# EAGLE design pisarnaInGarderoba-v2 (EAGLE 6.5.0)
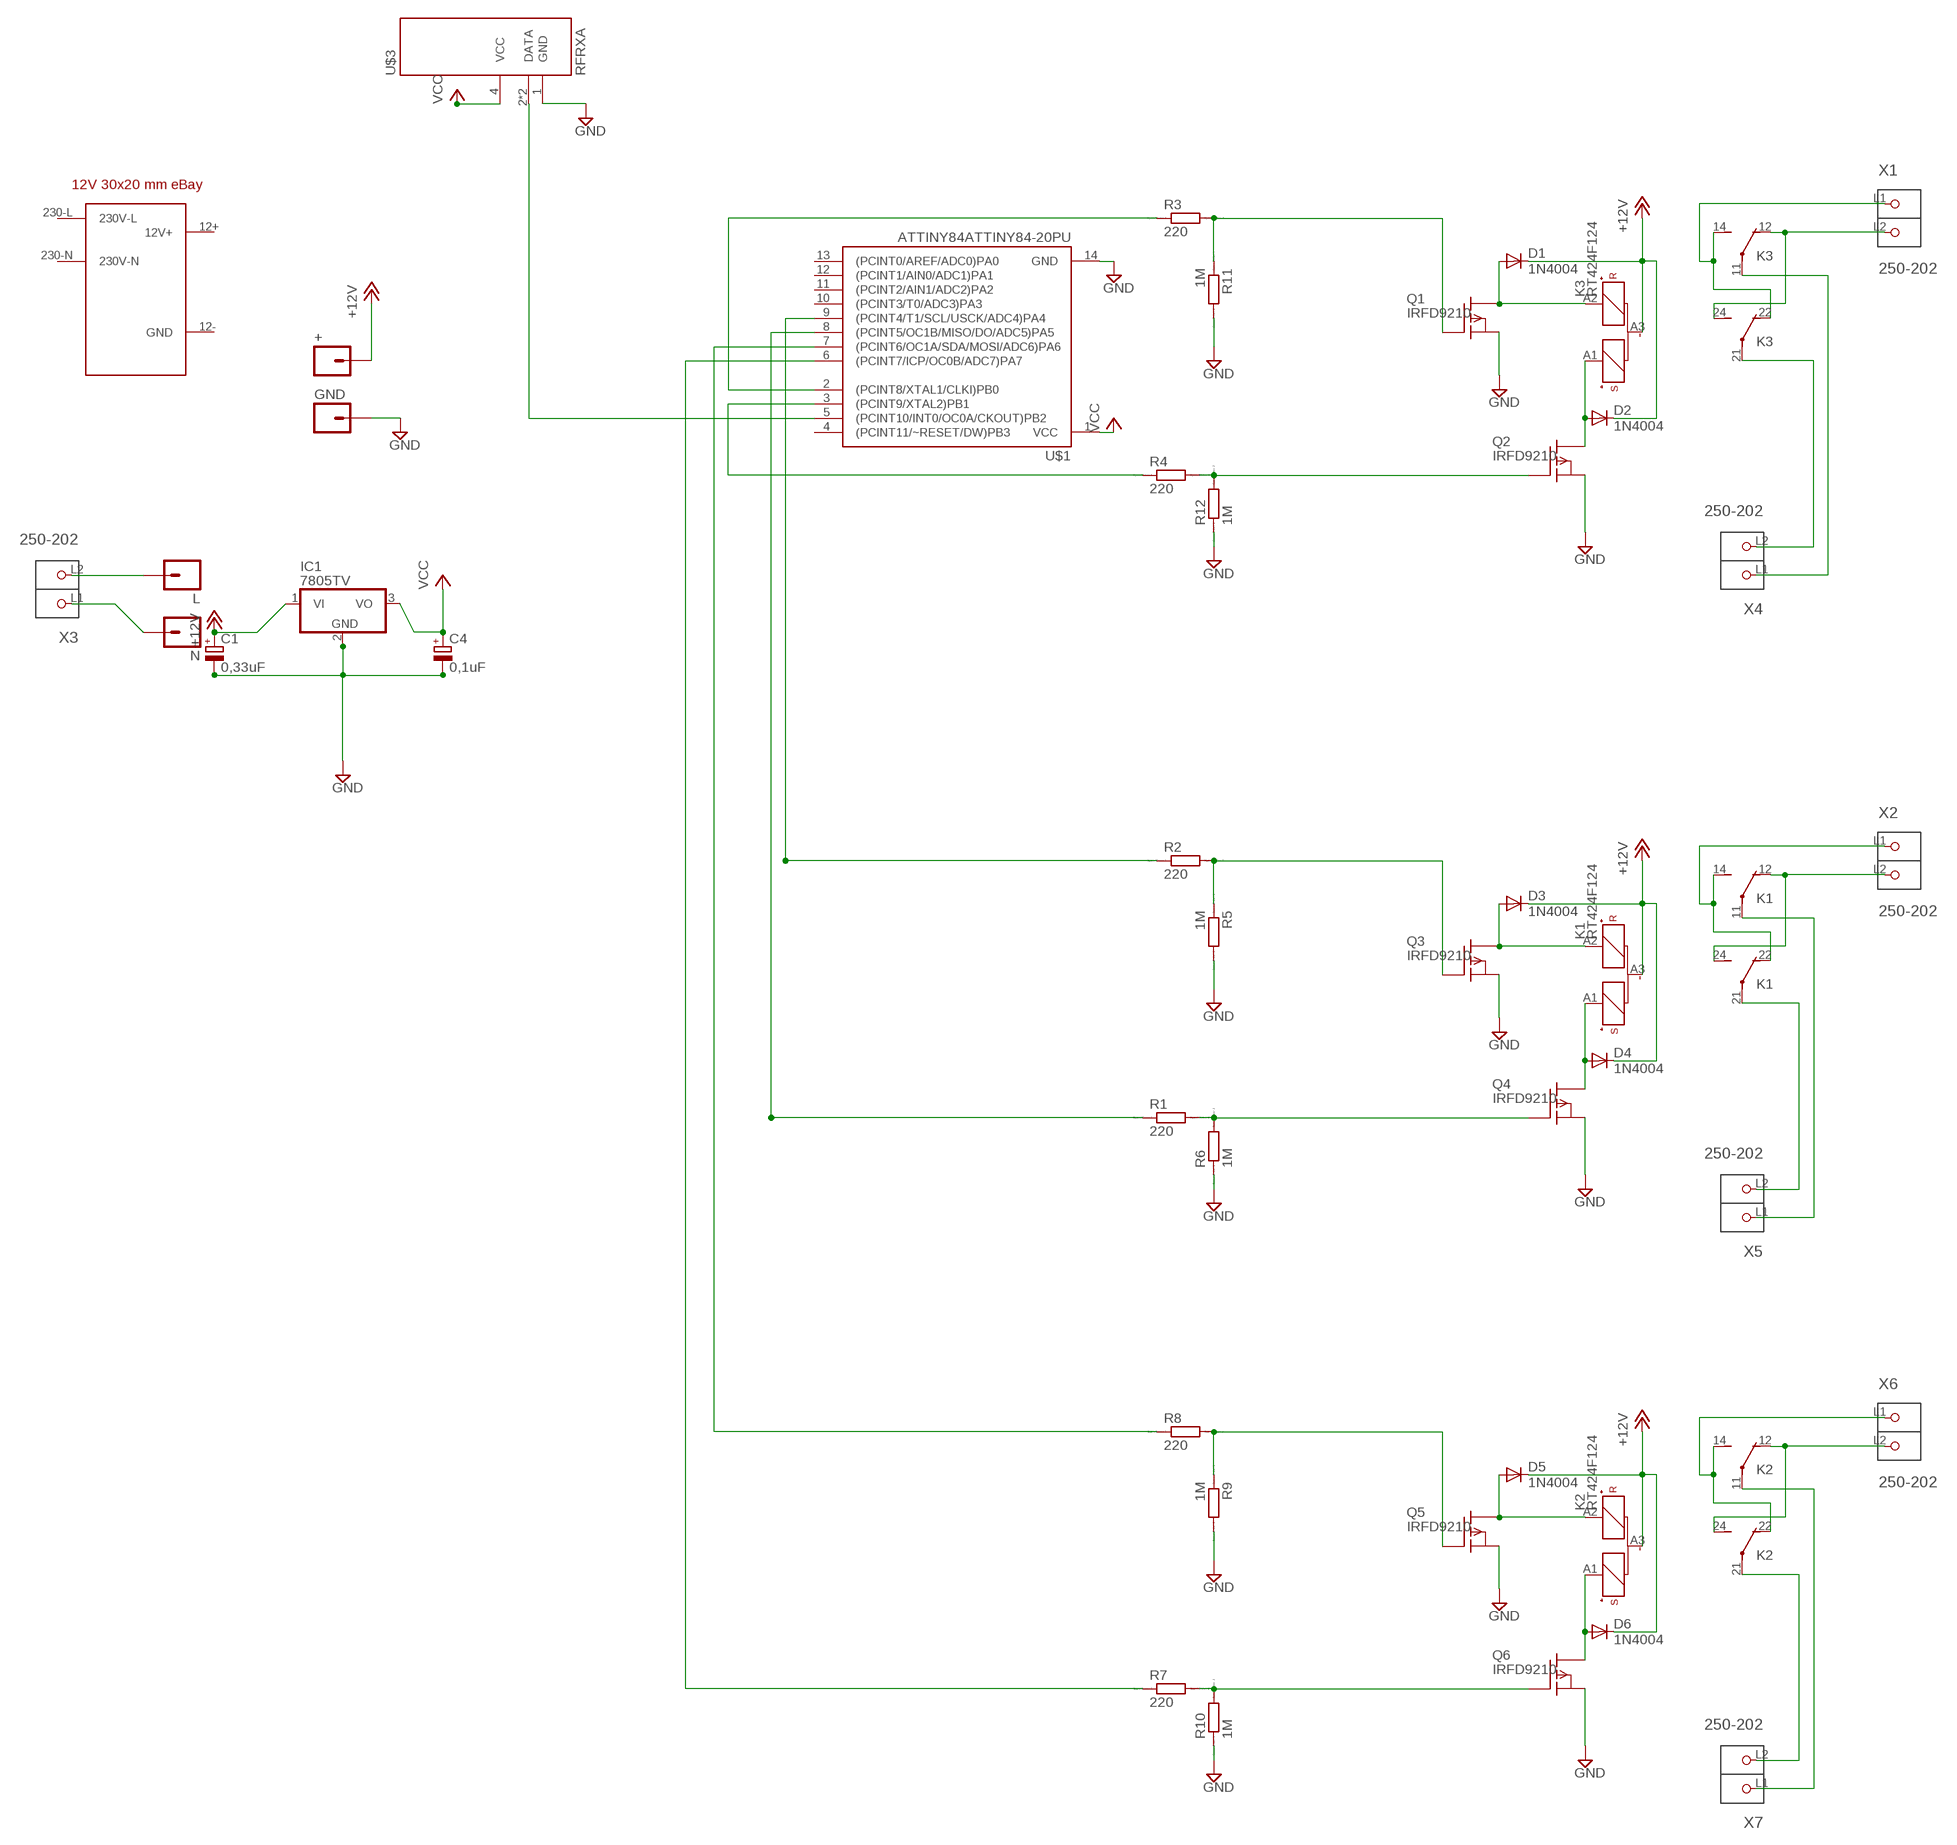
[diagram p0: schematic, sheet 1, part 1 of 2]
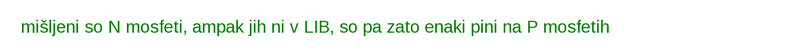
[diagram p1: schematic, sheet 1, part 2 of 2]

## Parts
+  M01PTH  [1X01]
C1  0,33uF  CPOL-EUE2.5-5  [E2,5-5]
C4  0,1uF  CPOL-EUE2.5-5  [E2,5-5]
D1  1N4004  [DO41-10]
D2  1N4004  [DO41-10]
D3  1N4004  [DO41-10]
D4  1N4004  [DO41-10]
D5  1N4004  [DO41-10]
D6  1N4004  [DO41-10]
GND  M01PTH  [1X01]
IC1  7805TV  [TO220V]
K1  RT424F124  [RT424]
K2  RT424F124  [RT424]
K3  RT424F124  [RT424]
L  M01PTH  [1X01]
N  M01PTH  [1X01]
Q1  IRFD9210  [DIL04]
Q2  IRFD9210  [DIL04]
Q3  IRFD9210  [DIL04]
Q4  IRFD9210  [DIL04]
Q5  IRFD9210  [DIL04]
Q6  IRFD9210  [DIL04]
R1  220  R0204/7  [0204/7]
R2  220  R0204/7  [0204/7]
R3  220  R0204/7  [0204/7]
R4  220  R0204/7  [0204/7]
R5  1M  R0204/7  [0204/7]
R6  1M  R0204/7  [0204/7]
R7  220  R0204/7  [0204/7]
R8  220  R0204/7  [0204/7]
R9  1M  R0204/7  [0204/7]
R10  1M  R0204/7  [0204/7]
R11  1M  R0204/7  [0204/7]
R12  1M  R0204/7  [0204/7]
U$1  ATTINY84ATTINY84-20PU  [DIL14]
U$2  12V-30X20  [12V30X20]
U$3  RFRXA  [IC]
X1  250-202  [P-250-202]
X2  250-202  [P-250-202]
X3  250-202  [P-250-202]
X4  250-202  [P-250-202]
X5  250-202  [P-250-202]
X6  250-202  [P-250-202]
X7  250-202  [P-250-202]

## Nets
+12V [mreza]: +.1 C1.+ D1.C D2.C D3.C D4.C D5.C D6.C IC1.1(VI) K1.A3(1:-) K2.A3(1:-) K3.A3(1:-)
GND: C1.- C4.- GND.1 IC1.2(GND) Q1.2(S) Q2.2(S) Q3.2(S) Q4.2(S) Q5.2(S) Q6.2(S) R5.2 R6.1 R9.2 R10.1 R11.2 R12.1 U$1.14(GND) U$3.1(GND)
N$1 [mreza]: K3.21(3:P) X4.L2(P2)
N$3 [mreza]: D2.A K3.A1(1:S+) Q2.3(D) Q2.4(D)
N$4 [mreza]: D1.A K3.A2(1:R+) Q1.3(D) Q1.4(D)
N$5: Q2.1(G) R4.2 R12.2
N$6 [mreza]: K3.11(2:P) X4.L1(P1)
N$7: Q1.1(G) R3.2 R11.1
N$8 [mreza]: K3.12(2:O) K3.24(3:S) X1.L2(P2)
N$9 [mreza]: K3.14(2:S) K3.22(3:O) X1.L1(P1)
N$10: R3.1 U$1.2((PCINT8/XTAL1/CLKI)PB0)
N$11: R4.1 U$1.3((PCINT9/XTAL2)PB1)
N$12: U$1.5((PCINT10/INT0/OC0A/CKOUT)PB2) U$3.2(DATA) U$3.3(DATA)
N$13 [mreza]: K1.21(3:P) X5.L2(P2)
N$14 [mreza]: K1.11(2:P) X5.L1(P1)
N$16: Q4.1(G) R1.2 R6.2
N$17: Q3.1(G) R2.2 R5.1
N$18: R8.1 U$1.7((PCINT6/OC1A/SDA/MOSI/ADC6)PA6)
N$19 [mreza]: D4.A K1.A1(1:S+) Q4.3(D) Q4.4(D)
N$20: R2.1 U$1.9((PCINT4/T1/SCL/USCK/ADC4)PA4)
N$21: R1.1 U$1.8((PCINT5/OC1B/MISO/DO/ADC5)PA5)
N$22 [mreza]: D3.A K1.A2(1:R+) Q3.3(D) Q3.4(D)
N$25 [mreza]: K1.12(2:O) K1.24(3:S) X2.L2(P2)
N$26 [mreza]: K1.14(2:S) K1.22(3:O) X2.L1(P1)
N$27: R7.1 U$1.6((PCINT7/ICP/OC0B/ADC7)PA7)
N$28: Q6.1(G) R7.2 R10.2
N$29: Q5.1(G) R8.2 R9.1
N$30 [mreza]: D6.A K2.A1(1:S+) Q6.3(D) Q6.4(D)
N$32 [mreza]: D5.A K2.A2(1:R+) Q5.3(D) Q5.4(D)
N$33 [mreza]: K2.12(2:O) K2.24(3:S) X6.L2(P2)
N$34 [mreza]: K2.14(2:S) K2.22(3:O) X6.L1(P1)
N$35 [mreza]: K2.21(3:P) X7.L2(P2)
N$36 [mreza]: K2.11(2:P) X7.L1(P1)
N$37 [mreza]: L.1 X3.L2(P2)
N$38 [mreza]: N.1 X3.L1(P1)
VCC: C4.+ IC1.3(VO) U$1.1(VCC) U$3.4(VCC)
Unconnected: U$1.4((PCINT11/~RESET/DW)PB3) U$1.10((PCINT3/T0/ADC3)PA3) U$1.11((PCINT2/AIN1/ADC2)PA2) U$1.12((PCINT1/AIN0/ADC1)PA1) U$1.13((PCINT0/AREF/ADC0)PA0) U$2.12+(12V+) U$2.12-(GND) U$2.230-L(230V-L) U$2.230-N(230V-N)

## Notes on the sheet
- mišljeni so N mosfeti, ampak jih ni v LIB, so pa zato enaki pini na P mosfetih

## Library data of the parts
+ GND L N = SparkFun-Connectors:M01: Header 1 Standard 1-pin 0.1" header. Use with straight break away headers (SKU : PRT-00116), right angle break away headers (PRT-00553), swiss pins (PRT-00743), machine pins (PRT-00117), and female headers (PRT-00115). SMTSO-256-ET is a "flush mount" nut for a 4-40 screw. The older package used to be too tight, and did not allow it to sit properly thru the drill hit. The latest (0.165DIA) fits nice and snug.
C1 C4 = resistor:CPOL-EU: POLARIZED CAPACITOR, European symbol; MF: SPC TECHNOLOGY; MPN: SPC15391; OC_FARNELL: 1653939
D1-D6 = diode:1N4004: DIODE general purpose rectifier, 1 A
IC1 = linear:78*: Positive VOLTAGE REGULATOR Source: http://cache.national.com/ds/LM/LM78L05.pdf http://www.fairchildsemi.com/ds/LM/LM7805.pdf; OC_FARNELL: unknown
K1-K3 = relay:RT424F*: Power PCB Relay polarized bistable version SCHRACK 2 pole 8 A Source: http://www.schrack.com/.. 5843.pdf; OC_FARNELL: unknown; OC_NEWARK: unknown
Q1-Q6 = transistor-fet:IRFD9210: P-Channel Enhancement MOSFET
R1-R12 = eagle-ltspice:R: RESISTOR, European symbol; OC_FARNELL: unknown; SPICEMODEL: NONE; SPICEPREFIX: R
U$1 = SparkFun-DigitalIC:ATTINY84: Atmel 14-pin 2/4/8kB flash uC
U$2 = nejc:12V-30X20
U$3 = RFRX-nejc:RFRX
X1-X7 = con-wago_250:250-202: Serie 250, 1-Leiter-Klemmenleiste für Leiterplatten 1 Lötstift/Pol versetzt / Series 250, 1-conductor PCB terminal strip 1 solder pin/pole, staggered Polzahl / Pole No.: 2 Rastermaß / Pitch: 3.5 - 3.5 mm Bemessungsspannung / Rated Voltage: 320 V Nennstrom / Nominal Current: 8 A Leiterquerschnitt / Conductor Size: 0.2 - 1.5 mm2 Anschlusstechnik / Connection Technology: CAGE CLAMP® S Lötstiftlänge: / Solder Pin Length: 3.6 mm Leitereinführung (zur Platine) / Conductor entry angle (to PCB): 45 ° Farbe / Color: grau / gray Stand: 01.01.2014. Die jeweils aktuellen Daten zu diesem Artikel finden Sie in unserem Produktkatalog, den Sie unter www.wago.com einsehen können. As of: 01/01/2014. Please find the newest data for this article in our product catalogue, which can be viewed under www.wago.com.

## Net classes
0 default: width 0.35 mm, drill 0.8 mm, clearance 0.35 mm
1 mreza: width 0.508 mm, drill 1.2 mm, clearance 0.508 mm

## Board
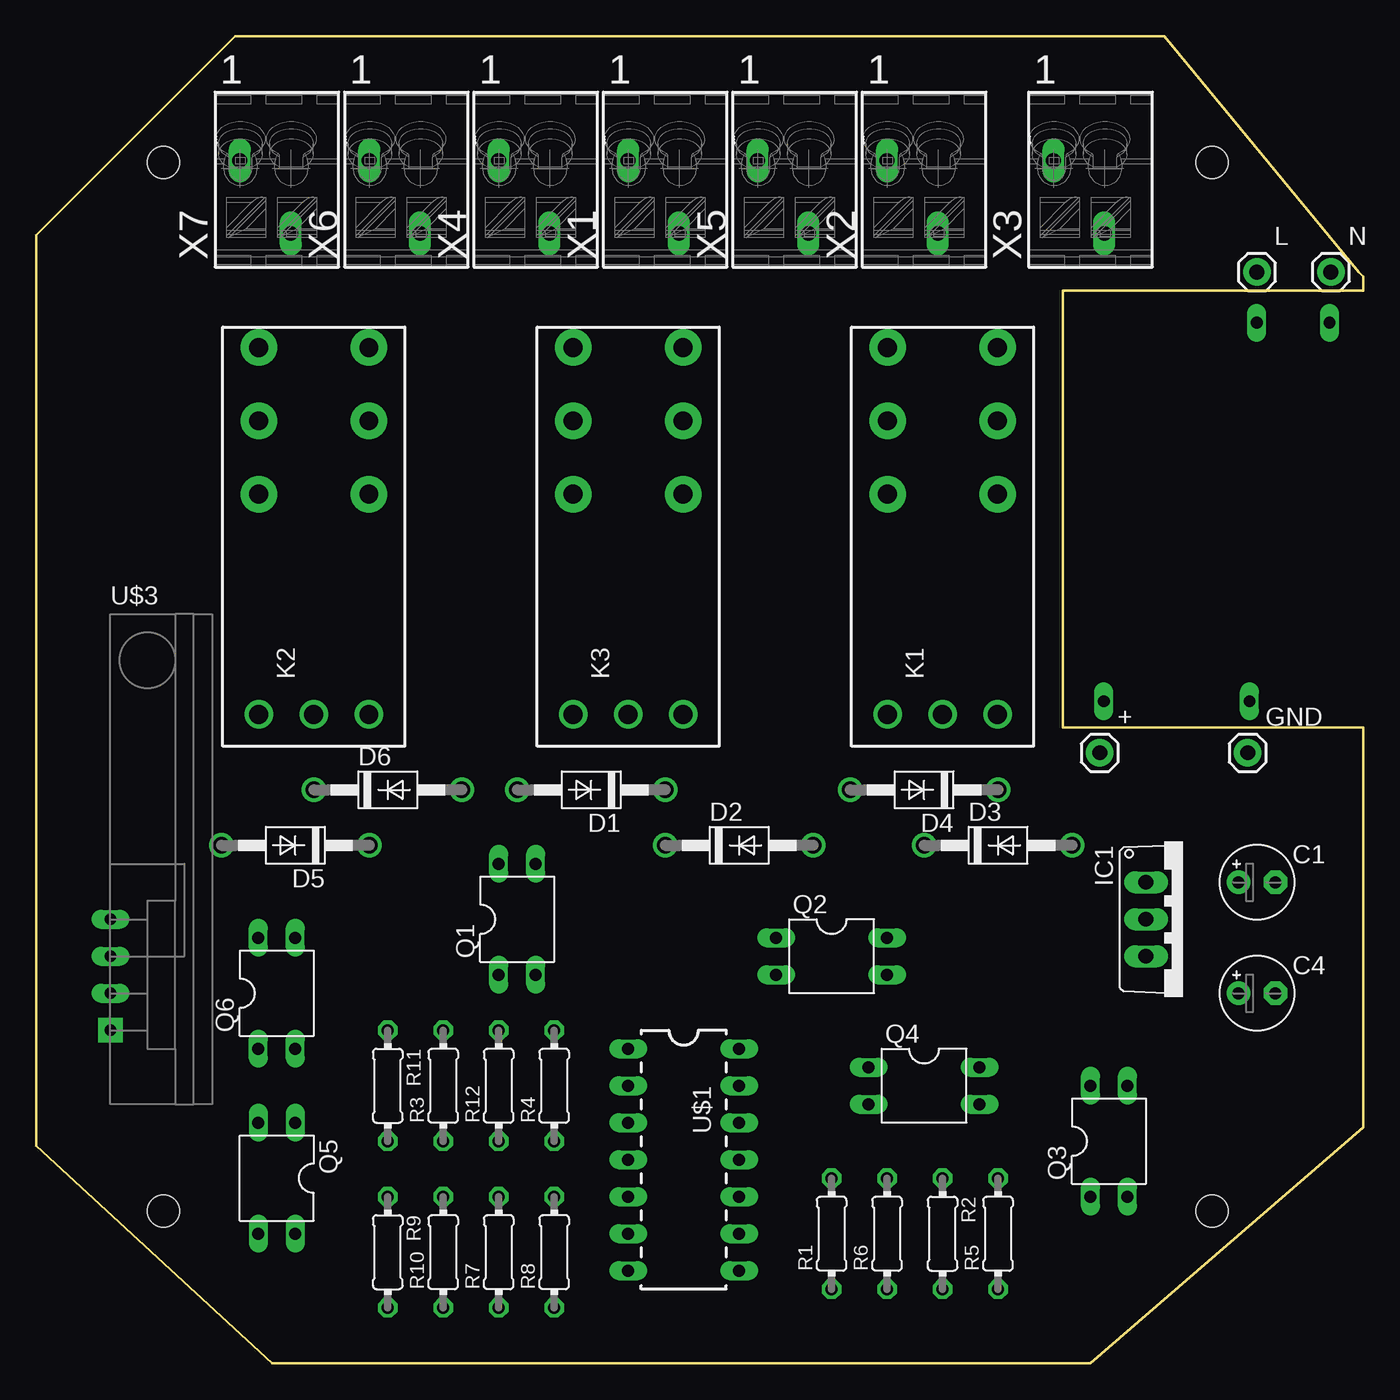
[diagram p2: board, top side]
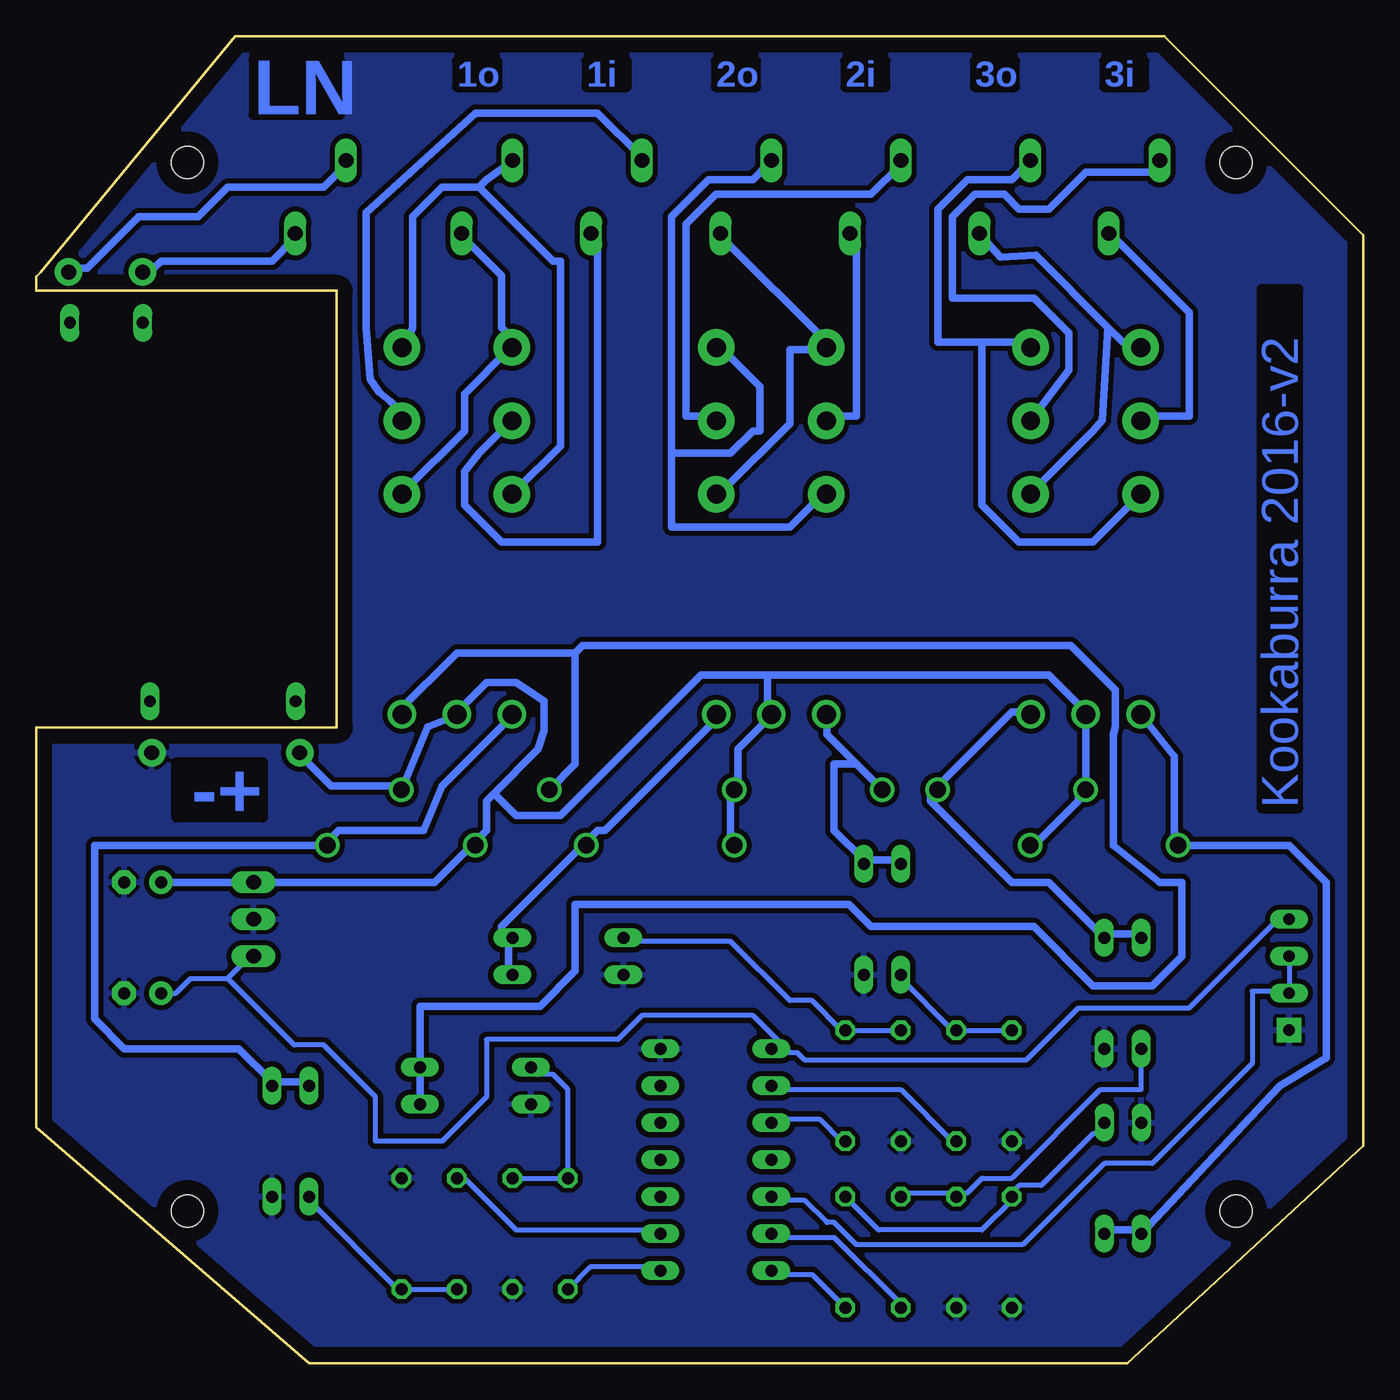
[diagram p3: board, bottom side, seen from below]

Size 91.11 x 91.11 mm. Coordinates in mm from the lower left corner, seen from the top.
Outline: 16.19,0 72.38,0 91.11,16.19 91.11,43.65 70.48,43.65 70.48,73.65 91.11,73.65 91.11,74.6 90.81,74.93 77.46,91.11 13.65,91.11 0,77.46 0,14.92 16.19,0
Copper layers (1*16): Top 0.035mm / dielectric 1.5mm / Bottom 0.035mm
Design rules "default": minimum track width 10mil, minimum drill 24mil, track to track 8mil, track to pad 8mil, pad to pad 8mil, via to via 8mil, smd to smd 8mil, copper to edge 40mil, drill to drill 8mil, minimum pad ring 10mil, minimum via ring 8mil, stop-mask expansion 4mil, vias tented up to drill 0mil, thermal gap 10mil
Holes 2.2 mm at 8.73,82.44 80.73,82.44 8.73,10.44 80.73,10.44

### Footprints (pad centres in the part's own frame; a part is rotated, then mirrored left to right if it is on the bottom)
1X01 = drill 1.016 pad 1.88: 1 0,0
E2,5-5 = drill 0.813 pad 1.6: + -1.27,0 | drill 0.813 pad 1.6 octagon: - 1.27,0
DO41-10 = drill 1.118: A 5.08,0; C -5.08,0
TO220V = drill 1.016 long: 1 -2.54,-2.54; 2 0,-2.54; 3 2.54,-2.54
RT424 = drill 1.3 pad 2.5: 11 7.56,-3.78; 12 2.52,-3.78; 14 12.6,-3.78; 21 7.56,3.78; 22 2.52,3.78; 24 12.6,3.78 | drill 1.3: A1 -12.6,-3.78; A2 -12.6,3.78; A3 -12.6,0
DIL04 = drill 0.813 long: 1 -1.27,-3.81; 2 1.27,-3.81; 3 1.27,3.81; 4 -1.27,3.81
0204/7 = drill 0.813 octagon: 1 -3.81,0; 2 3.81,0
DIL14 = drill 0.813 long: 1 -8.89,-3.81; 2 -6.35,-3.81; 3 -3.81,-3.81; 4 -1.27,-3.81; 5 1.27,-3.81; 6 3.81,-3.81; 7 6.35,-3.81; 8 6.35,3.81; 9 3.81,3.81; 10 1.27,3.81; 11 -1.27,3.81; 12 -3.81,3.81; 13 -6.35,3.81; 14 -8.89,3.81
12V30X20 = drill 0.8 long: 12+ 2.82,2.27; 12- 12.82,2.27; 230-L 18.32,28.27; 230-N 13.32,28.27
IC = drill 0.8 pad 1.676 square: 1 0,5.08 | drill 0.8 long: 2 0,7.62; 3 0,10.16; 4 0,12.7
P-250-202 = drill 1 long: L1 1.3,2.55; L2 -3.7,-0.95

### Placement (x,y rotation side)
+  73.03,41.91 0 top
C1  83.82,33.02 0 top
C4  83.82,25.4 0 top
D1  38.1,39.37 180 top
D2  48.26,35.56 0 top
D3  66.04,35.56 0 top
D4  60.96,39.37 180 top
D5  17.78,35.56 180 top
D6  24.13,39.37 0 top
GND  83.19,41.91 0 top
IC1  78.74,30.48 270 top
K1  62.23,57.15 90 top
K2  19.05,57.15 90 top
K3  40.64,57.15 90 top
L  83.82,74.93 0 top
N  88.9,74.93 0 top
Q1  33.02,30.48 0 top
Q2  54.61,27.94 270 top
Q3  73.66,15.24 0 top
Q4  60.96,19.05 270 top
Q5  16.51,12.7 180 top
Q6  16.51,25.4 0 top
R1  54.61,8.89 90 top
R2  62.23,8.89 270 top
R3  27.94,19.05 90 top
R4  35.56,19.05 90 top
R5  66.04,8.89 90 top
R6  58.42,8.89 90 top
R7  31.75,7.62 90 top
R8  35.56,7.62 90 top
R9  24.13,7.62 270 top
R10  27.94,7.62 90 top
R11  24.13,19.05 270 top
R12  31.75,19.05 90 top
U$1  44.45,12.7 270 top
U$2  70.48,43.18 0 top
U$3  5.08,17.78 0 top
X1  43.18,81.28 90 top
X2  60.96,81.28 90 top
X3  72.39,81.28 90 top
X4  34.29,81.28 90 top
X5  52.07,81.28 90 top
X6  25.4,81.28 90 top
X7  16.51,81.28 90 top

### Tracks (layer width: path | path; a pad name or v marks a point on that pad's centre or on a via)
+12V
  Bottom 0.508: C1.+ IC1.1 63.75,33.02 61.21,35.56 | +.1 72.9,41.66 70.87,39.62 66.29,39.62 D4.C 64.26,43.69 62.99,44.2 62.23,44.2 K1.A3 62.23,44.7 60.2,46.74 58.17,46.74 56.26,45.47 56.26,43.43 56.64,42.16 59.69,39.12 | 59.69,39.12 60.2,38.61 60.2,36.58 61.21,35.56 | 61.21,35.56 D3.C | D2.C 43.43,35.56 43.43,39.12 D1.C 42.93,39.62 42.93,42.16 40.89,44.2 K3.A3 40.89,44.7 40.89,47.24 | D5.C 22.61,35.56 19.56,38.61 19.56,39.12 19.05,39.12 D6.C K2.A3 19.05,44.7 19.56,44.7 19.56,45.21 21.59,47.24 40.89,47.24 | 59.69,39.12 58.17,37.59 55.12,37.59 45.47,47.24 40.89,47.24
GND
  pour Bottom: 13.97,91.44 0,77.47 0,15.24 16.51,-1.27 72.39,-1.27 91.44,16.51 91.44,44.45 71.12,44.45 71.12,73.03 91.44,73.03 91.44,74.93 86.36,81.28 77.47,91.44
N$1
  Bottom 0.508: X4.L2 34.8,77.22 34.8,65.02 36.83,65.02 K3.21
N$3
  Bottom 0.508: Q2.3 58.67,26.92 58.67,28.96 Q2.4 58.67,29.46 59.18,29.46 59.18,29.97 53.59,35.56 | 53.59,35.56 52.58,36.58 52.07,36.58 44.45,44.2 K3.A1 | 53.59,35.56 D2.A
N$4
  Bottom 0.508: 34.29,34.54 31.75,34.54 Q1.4 | 34.8,41.15 36.83,43.18 36.83,43.69 36.32,44.2 36.32,44.7 36.83,44.7 K3.A2 | 34.8,41.15 D1.A | 34.29,34.54 36.32,36.58 36.32,41.15 34.8,41.15 | 34.29,34.54 Q1.3
N$5
  Bottom 0.35: R12.2 R4.2 35.81,22.86 37.85,24.89 39.37,24.89 43.43,28.96 50.55,28.96 Q2.1
N$6
  Bottom 0.508: X4.L1 31.75,82.3 33.78,80.26 44.45,80.26 46.48,78.23 46.48,65.02 44.45,65.02 K3.11
N$7
  Bottom 0.35: R11.1 R3.2 28.19,22.86 31.75,26.42 Q1.1
N$8
  Bottom 0.508: X1.L2 43.94,77.22 36.83,70.1 K3.24 37.34,69.6 39.37,69.6 39.37,64.52 43.94,59.94 K3.12
N$9
  Bottom 0.508: 47.5,62.48 47.5,57.4 39.37,57.4 37.34,59.44 K3.22 | 47.5,62.48 47.5,78.74 44.96,81.28 41.91,81.28 40.89,82.3 X1.L1 | 47.5,62.48 43.43,62.48 41.91,64.01 41.4,64.01 41.4,67.06 43.94,69.6 K3.14
N$10
  Bottom 0.35: R3.1 28.19,15.24 31.75,18.8 40.39,18.8 U$1.2
N$11
  Bottom 0.35: R4.1 35.81,15.24 37.34,16.76 40.39,16.76 U$1.3
N$12
  Bottom 0.35: U$3.3 U$3.2 4.83,25.4 5.33,25.53 7.62,25.53 7.62,20.57 14.48,13.72 17.78,13.72 23.37,8.13 34.8,8.13 36.32,9.65 36.83,9.65 38.35,11.18 40.39,11.18 U$1.5
N$13
  Bottom 0.508: X5.L2 52.58,77.22 52.58,56.39 59.18,56.39 61.72,58.93 61.72,61.21 60.71,62.48 58.67,64.52 K1.21
N$14
  Bottom 0.508: X5.L1 49.53,82.8 52.58,85.85 60.96,85.85 68.45,78.99 68.45,71.12 68.2,67.56 67.56,66.67 66.8,66.04 65.79,65.02 K1.11
N$16
  Bottom 0.35: R6.2 R1.2 54.61,18.8 55.63,19.81 56.64,19.81 Q4.1
N$17
  Bottom 0.35: R2.2 R5.1 66.29,5.08 72.39,11.18 Q3.1
N$18
  Bottom 0.35: R8.1 37.85,6.1 40.39,6.1 U$1.7
N$19
  Bottom 0.508: Q4.3 Q4.4 64.77,24.51 56.51,24.51 54.1,26.92 54.1,31.5 35.31,31.5 33.78,29.97 22.61,29.97 18.54,25.91 14.48,25.91 12.45,27.94 12.45,33.02 13.97,33.02 17.14,35.56 17.14,43.18 17.02,43.69 17.02,46.23 20.07,49.28 53.59,49.28 54.1,48.77 | D4.A 54.1,41.15 54.1,48.77 | 54.1,48.77 62.23,48.77 66.29,44.7 K1.A1
N$20
  Bottom 0.35: R2.1 61.72,12.7 58.17,9.14 48.51,9.14 U$1.9
N$21
  Bottom 0.35: R1.1 53.09,6.6 48.51,6.6 U$1.8
N$22
  Bottom 0.508: 74.93,19.3 72.39,19.3 Q3.4 | 74.93,19.3 77.22,21.59 85.09,21.59 87.12,23.62 87.12,35.56 71.37,35.56 | 74.93,19.3 Q3.3 | 71.37,35.56 70.36,36.58 64.52,36.58 63.25,39.62 58.67,44.2 K1.A2 | 71.37,35.56 D3.A
N$25
  Bottom 0.508: X2.L2 61.72,77.22 59.18,74.68 59.18,71.12 58.17,70.1 K1.24 58.67,69.6 61.72,66.55 61.72,64.01 65.79,59.94 K1.12
N$26
  Bottom 0.508: 60.71,80.77 60.2,81.28 58.42,82.55 58.67,82.3 X2.L1 | 60.71,80.77 63.25,80.77 65.28,78.74 65.28,71.12 65.66,70.1 K1.14 | 60.71,80.77 55.63,75.69 55.12,75.69 55.12,62.99 58.17,59.94 K1.22
N$27
  Bottom 0.35: R7.1 31.75,4.06 36.32,8.64 40.39,8.64 U$1.6
N$28
  Bottom 0.35: R7.2 31.75,11.68 28.19,11.68 R10.2 27.69,11.68 27.18,11.68 26.16,12.7 24.13,12.7 18.03,18.8 15.24,18.8 Q6.1
N$29
  Bottom 0.35: Q5.1 17.53,16.26 18.03,15.75 18.54,15.75 22.1,12.19 23.62,12.19 24.13,11.68 R9.1 24.13,11.18 26.16,9.14 33.27,9.14 R8.2
N$30
  Bottom 0.508: Q6.4 15.49,29.46 17.53,29.46 Q6.3 21.59,33.02 24.13,33.02 29.72,38.61 29.72,39.12 29.21,39.12 D6.A 29.21,39.62 24.13,44.7 23.11,44.7 K2.A1
N$32
  Bottom 0.508: Q5.4 17.53,9.14 15.49,9.14 Q5.3 5.71,19.05 2.54,20.95 2.54,33.02 5.08,35.56 D5.A 12.95,35.56 12.95,41.66 14.99,44.2 K2.A2
N$33
  Bottom 0.508: 17.53,71.12 16.51,70.1 15.49,70.1 K2.24 | 17.53,71.12 22.48,76.07 24.89,75.95 X6.L2 | 17.53,71.12 17.91,64.77 18.54,64.01 22.61,59.94 K2.12
N$34
  Bottom 0.508: 26.16,70.1 23.11,70.1 K2.14 | 26.16,70.1 29.21,70.1 29.21,79.25 27.18,81.28 24.13,81.28 23.11,82.3 X6.L1 | 26.16,70.1 26.16,58.93 23.62,56.39 18.54,56.39 15.49,59.44 K2.22
N$35
  Bottom 0.508: X7.L2 17.02,77.22 11.94,72.14 11.94,65.02 14.99,65.02 K2.21
N$36
  Bottom 0.508: X7.L1 13.97,82.3 14.48,81.79 19.05,81.79 21.59,79.25 23.62,79.25 24.64,80.26 26.67,80.26 28.19,78.74 28.19,73.15 22.61,73.15 20.19,70.74 20.19,68.2 22.61,65.02 K2.11
N$37
  Bottom 0.508: X3.L2 73.41,77.22 74.93,75.69 82.55,75.69 83.06,75.18 83.57,75.18 L.1
N$38
  Bottom 0.508: X3.L1 69.85,82.3 71.37,80.77 77.98,80.77 80.01,78.74 84.07,78.74 87.63,75.18 88.65,75.18 N.1
VCC
  Bottom 0.35: 77.98,26.42 76.45,27.94 IC1.3 | 77.98,26.42 80.52,26.42 81.53,25.4 C4.+ | U$3.4 5.84,30.48 11.94,24.38 19.56,24.38 23.11,20.83 38.35,20.83 38.86,21.34 39.37,21.34 | 39.37,21.34 40.39,21.34 U$1.1 39.37,21.34 | 77.98,26.42 73.41,21.84 71.37,21.84 67.82,18.29 67.82,15.24 63.25,15.24 60.2,18.29 60.2,22.22 51.18,22.22 49.53,23.88 41.91,23.88 39.37,21.34

### Text on the board
Bottom: 3i | 3o | 2i | 2o | 1i | 1o | LN | Kookaburra 2016-v2 | +-